# Altium schematic sheet CPU.SchDoc
size A4; SheetNumber: 1; SheetTotal: 5
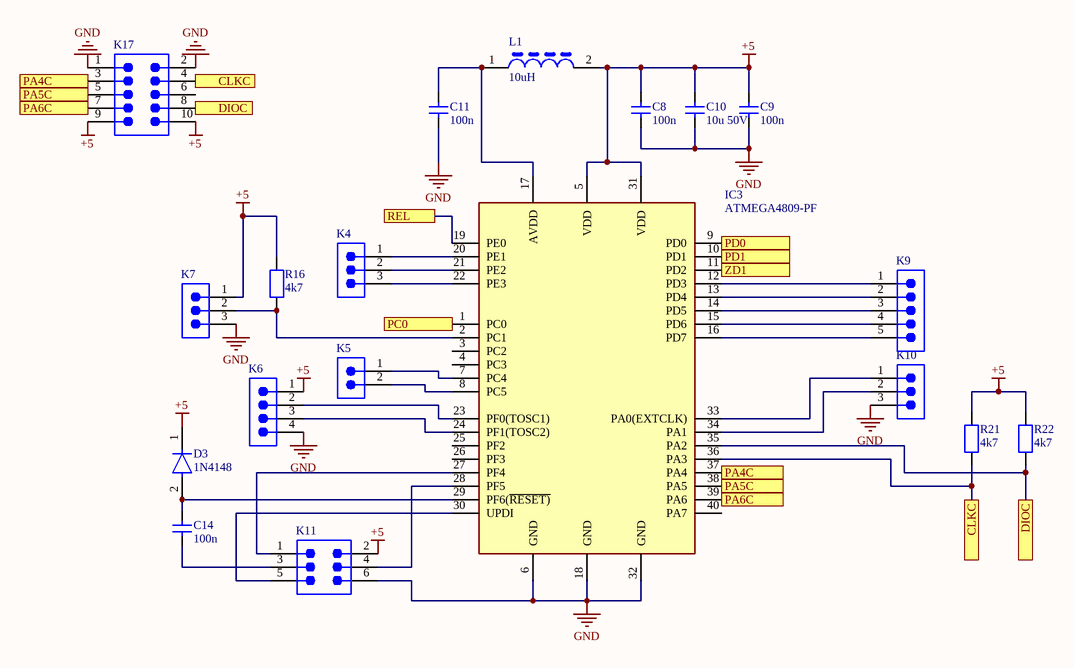
[diagram p0: CPU.SchDoc]

## Parts
C8  100n  [Capacitor100nf]
C9  100n  [Capacitor100nf]
C10  10u 50V  [Capacitor10uf]
C11  100n  [Capacitor100nf]
C14  100n  [Capacitor100nf]
D3  1N4148  [1N4148]
IC3  ATMEGA4809-PF  [ATMEGA4809-PF]
K4  (no value)  [[3][1]Pinheader]
K5  (no value)  [[2][1]Pinheader]
K6  (no value)  [[4][1]Pinheader]
K7  (no value)  [[3][1]Pinheader]
K9  (no value)  [[5][1]Pinheader]
K10  (no value)  [[3][1]Pinheader]
K11  (no value)  [[6][2]Pinheader]
K17  61231020621  [[10][2]Pinheader]  (value not drawn)
L1  10uH  [Smoorspoel]
R16  4k7  [Resistor]
R21  4k7  [Resistor]
R22  4k7  [Resistor]

## Ports
CLKC (see CPU[1A]), CLKC (see CPU[3C]), DIOC (see CPU[1A]), DIOC (see CPU[4C]), PA4C (see CPU[1A]), PA4C (see CPU[3C]), PA5C (see CPU[1A]), PA5C (see CPU[3C]), PA6C (see CPU[1A]), PA6C (see CPU[3C]), PC0 (see Regelaar[1B]), PD0 (see Versterker[2A]), PD1 (see Versterker[2B]), REL (see Voeding[2B]), ZD1 (see Voeding[4C])

## Nets
+5: C8.1 C9.1 C10.2 D3.1(C) IC3.5(VDD) IC3.31(VDD) K6.1 K7.1 K11.2 K17.9 K17.10 L1.2 R16.1 R21.2 R22.2
GND: C8.2 C9.2 C10.1 C11.2 IC3.6(GND) IC3.18(GND) IC3.32(GND) K6.4 K7.3 K10.3 K11.6 K17.1 K17.2
CLKC: IC3.36(PA3) K17.4 R21.1 ; port CLKC
DIOC: IC3.35(PA2) K17.8 R22.1 ; port DIOC
PA4C: IC3.37(PA4) K17.3 ; port PA4C
PA5C: IC3.38(PA5) K17.5 ; port PA5C
PA6C: IC3.39(PA6) K17.7 ; port PA6C
PC0: IC3.1(PC0) ; port PC0
PD0: IC3.9(PD0) ; port PD0
PD1: IC3.10(PD1) ; port PD1
REL: IC3.19(PE0) ; port REL
ZD1: IC3.11(PD2) ; port ZD1
NetC11_1: C11.1 IC3.17(AVDD) L1.1
NetC14_1: C14.1 K11.3
NetC14_2: C14.2 D3.2(A) IC3.29(PF6(~{RESET)})
NetIC3_2: IC3.2(PC1) K7.2 R16.2
NetIC3_7: IC3.7(PC4) K5.1
NetIC3_8: IC3.8(PC5) K5.2
NetIC3_12: IC3.12(PD3) K9.1
NetIC3_13: IC3.13(PD4) K9.2
NetIC3_14: IC3.14(PD5) K9.3
NetIC3_15: IC3.15(PD6) K9.4
NetIC3_16: IC3.16(PD7) K9.5
NetIC3_20: IC3.20(PE1) K4.1
NetIC3_21: IC3.21(PE2) K4.2
NetIC3_22: IC3.22(PE3) K4.3
NetIC3_23: IC3.23(PF0(TOSC1)) K6.2
NetIC3_24: IC3.24(PF1(TOSC2)) K6.3
NetIC3_27: IC3.27(PF4) K11.1
NetIC3_28: IC3.28(PF5) K11.4
NetIC3_30: IC3.30(UPDI) K11.5
NetIC3_33: IC3.33(PA0(EXTCLK)) K10.1
NetIC3_34: IC3.34(PA1) K10.2

Not connected (* = marked no-connect by the designer): IC3 3(PC2) 4(PC3) 25(PF2) 26(PF3) 40(PA7); K17 6

## Library data of the parts
C8-C11 C14 = Capacitor: CAP CER 10000PF 50V X7R 0805; NexarPartId: 65419863; Capacitance: 10nF; Tolerance: 10%; Material: Ceramic; Insulation Resistance: 10GΩ; Case Code (Metric): 2012; Voltage Rating (DC): 50V; Height: 800µm; REACH SVHC: Unknown; Length: 2mm; Case/Package: 0805; RoHS: Compliant; Dielectric: X7R; Packaging: Tape & Reel (TR); Mount: Surface Mount; Max Operating Temperature: 125°C; Thickness: 889µm; Voltage Rating: 50V; Width: 1.25mm; Case Code (Imperial): 0805; Min Operating Temperature: -55°C
D3 = Diode: Current Rating: 1A; Max Surge Current: 30A; Reverse Voltage: 1kV; Recovery Time: 2000ns; Element Configuration: Single; Polarity: Standard; Reverse Recovery Time: 2us; Capacitance: 15pF; Forward Voltage: 1V; Max Reverse Current: 5uA; Radiation Hardening: No; Number of Pins: 2; Output Current: 1A; Mount: Through Hole; Average Rectified Current: 1A; Lead Free: Lead Free; Peak Non-Repetitive Surge Current: 30A; Max Reverse Voltage (DC): 1kV; Voltage Rating (DC): 1kV; Max Repetitive Reverse Voltage (Vrrm): 1kV; Diameter: 2.7mm; Forward Current: 1A; RoHS Compliant: Yes; Package Quantity: 1; Length: 5.2mm; Max Forward Surge Current (Ifsm): 30A; Packaging: Tape and Reel; Case/Package: DO-41; Min Operating Temperature: -55°C; Max Operating Temperature: 150°C
IC3 = IC3: IC MCU 8BIT 48KB FLASH 40DIP; RoHS Compliant: Yes
K4 K7 K10 = [3][1]Pinheader: NexarPartId: 32855521; Voltage Rating: 250V; Current Rating: 3A; Connector Type: Male Pin; Number of Positions: 3; Gender: Male; Contact Resistance: 20mΩ; Pitch: 2.54mm; Max Operating Temperature: 105°C; Lead Pitch: 2.54mm; Lead Free: Lead Free; Contact Mating Length: 5.9944mm; Contact Material: Copper; Number of Pins: 3; Orientation: Vertical; Height: 8.94mm; Packaging: Bulk; Min Operating Temperature: -40°C; Mount: Through Hole; RoHS: Compliant; Number of Contacts: 3; Operating Supply Voltage: 250V; Termination: Solder; Number of Rows: 1; Contact Plating: Gold; Color: Black; REACH SVHC: Unknown
K5 = [2][1]Pinheader: NexarPartId: 20081794; Operating Supply Voltage: 250V; Current Rating: 3A; Gender: Male; Number of Contacts: 2; Pitch: 2.54mm; Connector Type: Male Pin; Contact Resistance: 20mΩ; Contact Plating: Gold; Contact Material: Copper; Number of Pins: 2; Min Operating Temperature: -40°C; Packaging: Bulk; Lead Pitch: 2.54mm; Mount: Through Hole; Orientation: Vertical; RoHS: Compliant; REACH SVHC: No SVHC; Height: 8.94mm; Termination: Through Hole; Number of Positions: 2; Contact Mating Length: 5.9944mm; Color: Black; Contact Gender: Male; Number of Rows: 1; Housing Material: PBT; Lead Free: Lead Free; Voltage Rating: 250V; Max Operating Temperature: 125°C
K6 = [4][1]Pinheader: NexarPartId: 32855522; Pitch: 2.54mm; Number of Contacts: 4; Contact Resistance: 20mΩ; Gender: Male; Current Rating: 3A; Connector Type: Male Pin; Voltage Rating: 250V; Lead Free: Lead Free; Contact Plating: Gold; Max Operating Temperature: 105°C; Packaging: Bulk; Height: 8.89mm; Orientation: Vertical; Contact Mating Length: 5.9944mm; Contact Material: Copper; Lead Pitch: 2.54mm; Min Operating Temperature: -40°C; Termination: Solder; Color: Black; Number of Rows: 1; REACH SVHC: Unknown; RoHS: Compliant; Mount: Through Hole; Number of Positions: 4; Number of Pins: 4; Operating Supply Voltage: 250V
K9 = [5][1]Pinheader: NexarPartId: 32855526; Operating Supply Voltage: 250V; Number of Contacts: 5; Connector Type: Male Pin; Current Rating: 3A; Contact Resistance: 20mΩ; Pitch: 2.54mm; Gender: Male; Termination: Solder; RoHS: Compliant; Lead Pitch: 2.54mm; Contact Mating Length: 5.9944mm; Number of Positions: 5; Lead Free: Lead Free; Contact Plating: Gold; Number of Pins: 5; Min Operating Temperature: -40°C; Voltage Rating: 250V; Color: Black; Mount: Through Hole; REACH SVHC: Unknown; Packaging: Bulk; Height: 8.89mm; Number of Rows: 1; Orientation: Vertical; Contact Material: Copper; Max Operating Temperature: 105°C
K11 = [6][2]Pinheader: NexarPartId: 32855428; Row Spacing: 2.54mm; Number of Contacts: 6; Contact Resistance: 20mΩ; Operating Supply Voltage: 250V; Current Rating: 3A; Gender: Male; Connector Type: Male Pin; Lead Pitch: 2.54mm; Mount: Surface Mount; REACH SVHC: Unknown; Contact Plating: Gold; Color: Black; Contact Mating Length: 5.9944mm; RoHS: Compliant; Orientation: Vertical; Contact Material: Copper; Pitch: 2.54mm; Termination: Solder; Number of Pins: 6; Number of Positions: 6; Number of Rows: 2
K17 = [10][2]Pinheader: NexarPartId: 32855511; Gender: Male; Pitch: 2.54mm; Number of Contacts: 10; Insulation Resistance: 1GΩ; Current Rating: 3A; Connector Type: Male Pin; Operating Supply Voltage: 250V; Contact Resistance: 20mΩ; Contact Mating Length: 5.0038mm; Number of Pins: 10; Color: Black; Number of Rows: 2; RoHS: Compliant; Row Spacing: 2.54mm; Orientation: Vertical; Packaging: Tape and Reel; Length: 18.02mm; Number of Positions: 10; Contact Material: Copper; Termination: Solder; Contact Plating: Gold; Mount: Surface Mount; Lead Pitch: 2.54mm; REACH SVHC: Unknown; Max Operating Temperature: 125°C; Min Operating Temperature: -40°C
L1 = Smoorspoel: Inductor VLS6045EX-100M-H; Manufacturer_Name: TDK; Datasheet Link: https://componentsearchengine.com//VLS6045EX-100M-H.pdf; Mouser2 Part Number: 810-VLS6045EX-100M-H; Mouser2 Price/Stock: https://www.mouser.com/Search/Refine.aspx?Keyword=810-VLS6045EX-100M-H; Manufacturer_Part_Number: VLS6045EX-100M-H
R16 R21 R22 = Resistor: Manufacturer: Vishay Dale; Part Number: CRCW08050000Z0EA